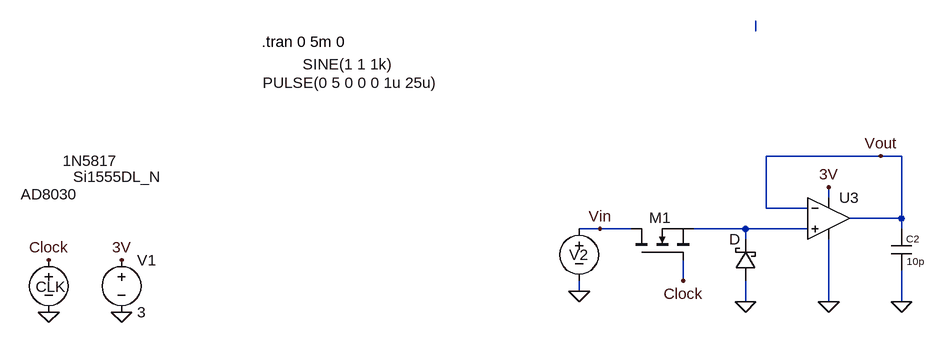
[diagram p0: schematic Sample and Hold.asc]
Sample and Hold.asc, the LTspice schematic file:
Version 4
SHEET 1 1140 680
WIRE 464 -240 464 -256
WIRE 656 -48 480 -48
WIRE 688 -48 656 -48
WIRE 576 16 576 0
WIRE 480 32 480 -48
WIRE 544 32 480 32
WIRE 688 48 688 -48
WIRE 688 48 608 48
WIRE 224 64 192 64
WIRE 272 64 224 64
WIRE 448 64 368 64
WIRE 544 64 448 64
WIRE 688 64 688 48
WIRE 448 80 448 64
WIRE 352 144 352 112
WIRE 192 160 192 144
WIRE 448 176 448 144
WIRE 576 176 576 80
WIRE 688 176 688 128
FLAG -624 112 Clock
FLAG -624 192 0
FLAG 224 64 Vin
FLAG 192 160 0
FLAG -512 112 3V
FLAG -512 192 0
FLAG 576 0 3V
FLAG 576 176 0
FLAG 688 176 0
FLAG 352 144 Clock
FLAG 448 176 0
FLAG 656 -48 Vout
SYMBOL voltage -624 96 R0
WINDOW 0 -20 57 Left 2
WINDOW 3 329 -257 Left 2
WINDOW 123 0 0 Left 0
WINDOW 39 0 0 Left 0
SYMATTR InstName CLK
SYMATTR Value PULSE(0 5 0 0 0 1u 25u)
SYMBOL voltage -512 96 R0
WINDOW 123 0 0 Left 0
WINDOW 39 0 0 Left 0
SYMATTR InstName V1
SYMATTR Value 3
SYMBOL voltage 192 48 R0
WINDOW 0 -15 56 Left 2
WINDOW 3 -425 -237 Left 2
WINDOW 123 0 0 Left 0
WINDOW 39 0 0 Left 0
SYMATTR InstName V2
SYMATTR Value SINE(1 1 1k)
SYMBOL cap 672 64 R0
WINDOW 0 23 15 Left 1
WINDOW 3 24 50 Left 1
SYMATTR InstName C2
SYMATTR Value 10p
SYMBOL nmos 272 112 R270
WINDOW 0 65 28 VRight 2
WINDOW 3 128 -858 VRight 2
SYMATTR InstName M1
SYMATTR Value Si1555DL_N
SYMBOL schottky 464 144 R180
WINDOW 0 24 64 Left 2
WINDOW 3 982 185 Left 2
SYMATTR InstName D
SYMATTR Value 1N5817
SYMATTR Description Diode
SYMATTR Type diode
SYMBOL OpAmps\\AD8030 576 -16 R0
WINDOW 3 -1243 27 Left 2
SYMATTR InstName U3
TEXT -296 -224 Left 2 !.tran 0 5m 0

The netlist it stands for:
* Sample and Hold.asc
V§CLK Clock 0 PULSE(0 5 0 0 0 1u 25u)
V1 3V 0 3
V2 Vin 0 SINE(1 1 1k)
C2 Vout 0 10p
M1 Vin Clock N002 N002 Si1555DL_N
D 0 N002 1N5817
XU3 N002 Vout 3V 0 Vout AD8040  ; AD8030, pins In+ In- V+ V- OUT
.model D D
.lib standard.dio
.model NMOS NMOS
.model PMOS PMOS
.lib standard.mos
.tran 0 5m 0
.lib ADI.lib
.backanno
.end